# Altium schematic sheet Banker_VHDCI_2_EDGE.SchDoc: Banker VHDCI to EDGE
size 420 x 297 mm; Author: G.Kasprowicz; CompanyName: WUT ISE; DrawnBy: G.Kasprowicz; Organization: WUT ISE; Address1: PW ISE; Address2: Nowowiejska 15/19 00-665 Warsaw; Address3: gkasprow@gmail.com; Revision: 1.0; SheetNumber: -; SheetTotal: -; ModifiedBy: -; CheckedDate: -; Title2: adapter; DivGrp: WUT ISE; Designer: G.Kasprowicz; ModifiedDate: -; ProjectName: Sensor Box
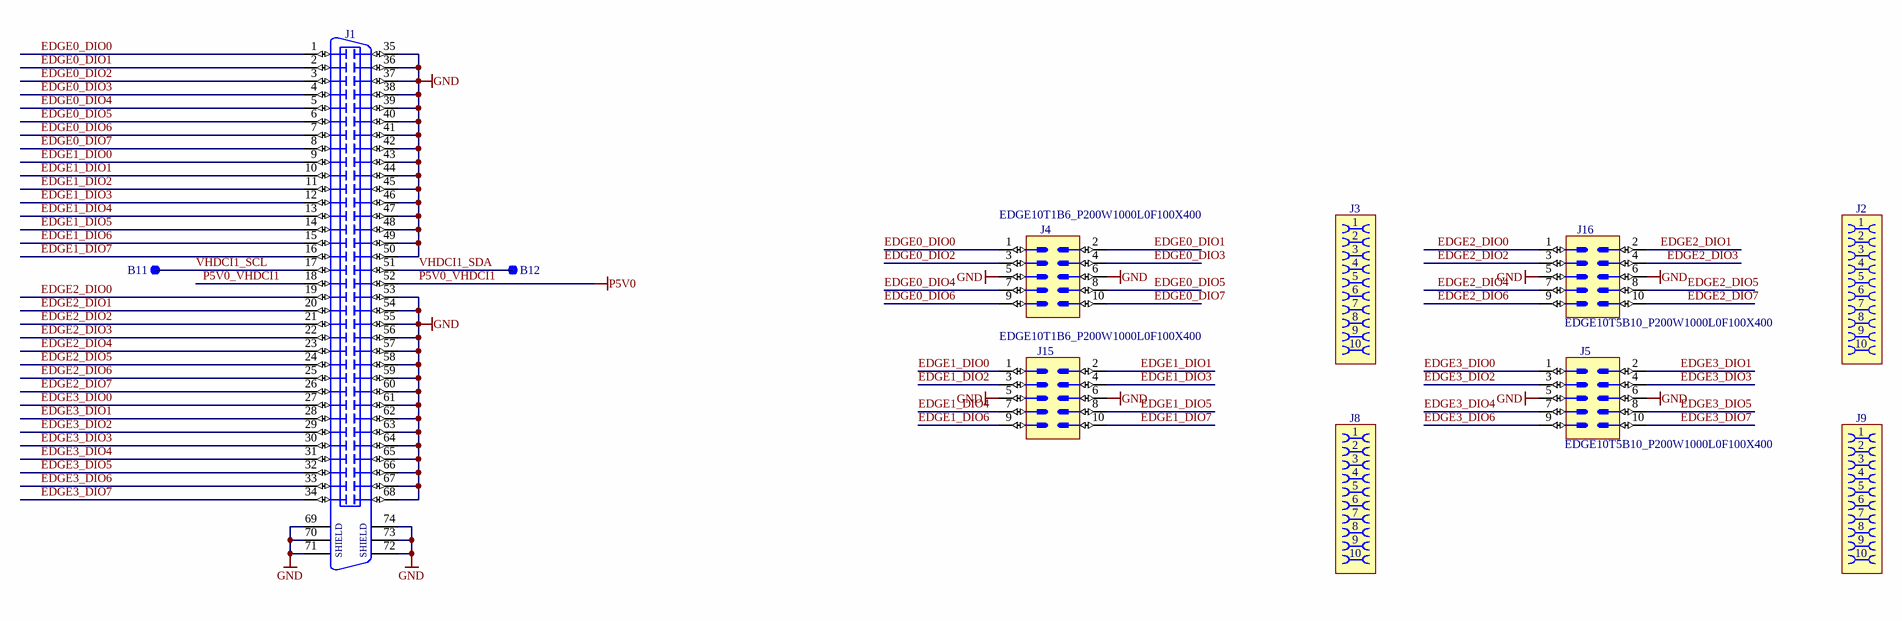
[diagram p0: Banker_VHDCI_2_EDGE.SchDoc]

## Parts
B11  SMD Pad  [C100]  (value not drawn)
B12  SMD Pad  [C100]  (value not drawn)
J1  VHDCI  [MOLEX_73776-0201]  (value not drawn)
J2  (no value)  [AVX_00 9159 010 061 916]
J3  (no value)  [AVX_00 9159 010 061 916]
J4  (no value)  [EDGE10T1B6_P200W1000L0F100X400]
J5  (no value)  [EDGE10T5B10_P200W1000L0F100X400]
J8  (no value)  [AVX_00 9159 010 061 916]
J9  (no value)  [AVX_00 9159 010 061 916]
J15  (no value)  [EDGE10T1B6_P200W1000L0F100X400]
J16  (no value)  [EDGE10T5B10_P200W1000L0F100X400]

## Nets
GND: J1.35 J1.36 J1.37 J1.38 J1.39 J1.40 J1.41 J1.42 J1.43 J1.44 J1.45 J1.46 J1.47 J1.48 J1.49 J1.50 J1.53 J1.54 J1.55 J1.56 J1.57 J1.58 J1.59 J1.60 J1.61 J1.62 J1.63 J1.64 J1.65 J1.66 J1.67 J1.68 J1.69 J1.70 J1.71 J1.72 J1.73 J1.74 J4.5 J4.6 J5.5 J5.6 J15.5 J15.6 J16.5 J16.6
P5V0_VHDCI1: J1.18 J1.52  [also labelled P5V0]
EDGE0_DIO0: J1.1 J4.1
EDGE0_DIO1: J1.2 J4.2
EDGE0_DIO2: J1.3 J4.3
EDGE0_DIO3: J1.4 J4.4
EDGE0_DIO4: J1.5 J4.7
EDGE0_DIO5: J1.6 J4.8
EDGE0_DIO6: J1.7 J4.9
EDGE0_DIO7: J1.8 J4.10
EDGE1_DIO0: J1.9 J15.1
EDGE1_DIO1: J1.10 J15.2
EDGE1_DIO2: J1.11 J15.3
EDGE1_DIO3: J1.12 J15.4
EDGE1_DIO4: J1.13 J15.7
EDGE1_DIO5: J1.14 J15.8
EDGE1_DIO6: J1.15 J15.9
EDGE1_DIO7: J1.16 J15.10
EDGE2_DIO0: J1.19 J16.1
EDGE2_DIO1: J1.20 J16.2
EDGE2_DIO2: J1.21 J16.3
EDGE2_DIO3: J1.22 J16.4
EDGE2_DIO4: J1.23 J16.7
EDGE2_DIO5: J1.24 J16.8
EDGE2_DIO6: J1.25 J16.9
EDGE2_DIO7: J1.26 J16.10
EDGE3_DIO0: J1.27 J5.1
EDGE3_DIO1: J1.28 J5.2
EDGE3_DIO2: J1.29 J5.3
EDGE3_DIO3: J1.30 J5.4
EDGE3_DIO4: J1.31 J5.7
EDGE3_DIO5: J1.32 J5.8
EDGE3_DIO6: J1.33 J5.9
EDGE3_DIO7: J1.34 J5.10
VHDCI1_SCL: B11.1 J1.17
VHDCI1_SDA: B12.1 J1.51

## Notes on the sheet
- Project/Equipment
- Document
- Designer
- Drawn by
- Check.by
- Copyright WUT ISE 2018.
  This documentation describes Open Hardware and is licensed under the CERN OHL v.1.1. You may redistribute and modify this documentation under the terms of the CERN OHL v.1.1. (http://ohwr.org/CERNOHL). This documentation is distributed WITHOUT ANY EXPRESS OR IMPLIED WARRANTY, INCLUDING OF MERCHANTABILITY, SATISFACTORY QUALITY AND FITNESS FOR A PARTICULAR PURPOSE. Please see the CERN OHL v.1.1 for applicable conditions.
- Contact
- File
- Last Mod.
- Print Date
- Sheet
- Size
- A3
- of
- Rev
- (in symbol MOLEX_73776-0201) SHIELD

## Library data of the parts
B11 B12 = SMD_PAD_D1MM: Through Hole Pad; Part Description: 1mm Diameter SMD Pad; Mounted: No; Part Number: SMD_PAD_D1MM; Component Kind: Standard (No BOM); Component Type: Standard (No BOM); Pin Count: 1; Family: SMD Pad; Socket: No; SMD: No; Sense: No; Status: None; ComponentHeight: 0mm; HelpURL: Undefined; Author: CERN DEM JLC; CreateDate: 10.10.2017; LatestRevisionDate: 10.10.2017; PackageDescription: 1mm Diameter SMD Pad
J1 = MOLEX_73776-0201: 0.80mm Pitch, 68 Contacts, Ultra+ VHDCI Surface Mount Vertical Receptacle; Part Description: 0.80mm Pitch, 68 Contacts, Ultra+ VHDCI Surface Mount Vertical Receptacle With Screwlock Kit; Manufacturer: MOLEX; PressFit: No; Part Number: MOLEX_73776-0201; Component Kind: Standard; Component Type: Standard; Pin Count: 74; Family: VHDCI; Mounted: Yes; Socket: No; SMD: Yes; Sense: No; Status: None; Manufacturer Part Number: 73776-0201; ComponentHeight: 10.7mm; HelpURL: \\cern.ch\dfs\Applications\Altium\Datasheets\MOLEX_73776-0201.pdf; Author: CERN DEM JLC; CreateDate: 14/01/2013; LatestRevisionDate: 14/01/2013
J2 J3 J8 J9 = AVX_00 9159 010 061 916: Open Ended Card Edge Connector, 9159 Series; Part Description: 10 Contacts, 2mm Pitch, Open Ended Card Edge Connector, 9159 Series; Manufacturer: AVX; PressFit: No; Part Number: AVX_00 9159 010 061 916; Component Kind: Standard; Component Type: Standard; Pin Count: 10; Mounted: Yes; Socket: No; SMD: No; Sense: No; Status: None; Manufacturer Part Number: 00 9159 010 061 916; ComponentHeight: 1.6mm; HelpURL: \\cern.ch\dfs\Applications\Altium\Datasheets\AVX_00 9159 010 061 916.pdf; Author: CERN DEM MR; CreateDate: 13.02.2018; LatestRevisionDate: 13.02.2018
J4 J15 = EDGE10T1B6_P200W1000L0F100X400: PCB Edge Connector 10 (2x5); Part Description: 10 Contacts Board Edge Connector, Pitch 2mm, Length 0mm, Width 10mm, Finger Lenght 4mm, Finger Width 1mm; Mounted: No; PressFit: No; Part Number: EDGE10T1B6_P200W1000L0F100X400; Component Kind: Standard (No BOM); Component Type: Standard (No BOM); Pin Count: 10; Socket: No; SMD: No; Sense: No; Status: None; ComponentHeight: 0mm; HelpURL: \\cern.ch\dfs\Applications\Altium\Datasheets\EDGE10T1B6_P200W1000L0F100X400.pdf; Author: CERN DEM MR; CreateDate: 14.02.2018; LatestRevisionDate: 14.02.2018
J5 J16 = EDGE10T5B10_P200W1000L0F100X400: PCB Edge Connector 10 (2x5); Part Description: 10 Contacts Board Edge Connector, Pitch 2mm, Length 0mm, Width 10mm, Finger Lenght 4mm, Finger Width 1mm; Mounted: No; PressFit: No; Part Number: EDGE10T5B10_P200W1000L0F100X400; Component Kind: Standard (No BOM); Component Type: Standard (No BOM); Pin Count: 10; Socket: No; SMD: No; Sense: No; Status: None; ComponentHeight: 0mm; HelpURL: \\cern.ch\dfs\Applications\Altium\Datasheets\EDGE10T5B10_P200W1000L0F100X400.pdf; Author: CERN DEM MR; CreateDate: 14.02.2018; LatestRevisionDate: 14.02.2018